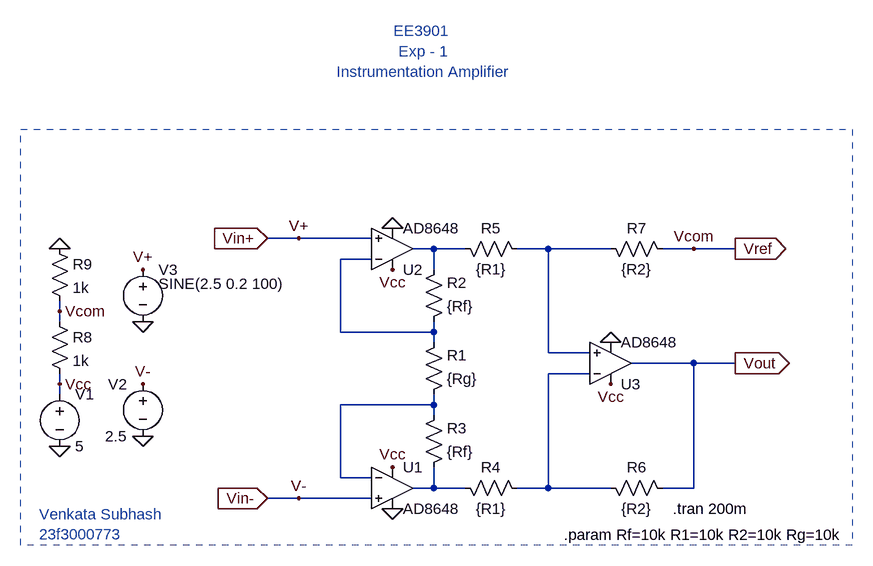
[diagram p0: schematic Exp_1_Instrumentation_amplifier.asc]
Exp_1_Instrumentation_amplifier.asc, the LTspice schematic file:
Version 4
SHEET 1 1060 680
WIRE 160 192 112 192
WIRE 272 192 160 192
WIRE 368 208 336 208
WIRE 416 208 368 208
WIRE 544 208 496 208
WIRE 640 208 544 208
WIRE 768 208 720 208
WIRE 832 208 768 208
WIRE 272 224 224 224
WIRE 368 240 368 208
WIRE -208 304 -208 288
WIRE -208 320 -208 304
WIRE 224 336 224 224
WIRE 368 336 368 320
WIRE 368 336 224 336
WIRE 368 352 368 336
WIRE 544 368 544 208
WIRE 608 368 544 368
WIRE 768 384 672 384
WIRE 832 384 768 384
WIRE 608 400 544 400
WIRE -208 416 -208 400
WIRE -208 432 -208 416
WIRE 368 448 368 432
WIRE 368 448 224 448
WIRE 368 464 368 448
WIRE 224 560 224 448
WIRE 272 560 224 560
WIRE 368 576 368 544
WIRE 368 576 336 576
WIRE 416 576 368 576
WIRE 544 576 544 400
WIRE 544 576 496 576
WIRE 640 576 544 576
WIRE 768 576 768 384
WIRE 768 576 720 576
WIRE 160 592 112 592
WIRE 272 592 160 592
FLAG -208 512 0
FLAG 304 608 0
FLAG 304 176 0
FLAG 640 352 0
FLAG -208 416 Vcc
FLAG 304 544 Vcc
FLAG 304 240 Vcc
FLAG 640 416 Vcc
FLAG 112 592 Vin-
IOPIN 112 592 In
FLAG 112 192 Vin+
IOPIN 112 192 In
FLAG 832 384 Vout
IOPIN 832 384 Out
FLAG 832 208 Vref
IOPIN 832 208 Out
FLAG -208 304 Vcom
FLAG -208 208 0
FLAG -80 320 0
FLAG -80 496 0
FLAG -80 240 V+
FLAG 160 192 V+
FLAG -80 416 V-
FLAG 160 592 V-
FLAG 768 208 Vcom
SYMBOL AD8648 304 272 M180
SYMATTR InstName U2
SYMBOL AD8648 640 448 M180
SYMATTR InstName U3
SYMBOL Voltage -208 416 R0
SYMATTR InstName V1
SYMATTR Value 5
SYMBOL AD8648 304 512 R0
SYMATTR InstName U1
SYMBOL Res 352 448 M180
WINDOW 0 36 76 Left 2
WINDOW 3 36 40 Left 2
SYMATTR InstName R1
SYMATTR Value {Rg}
SYMBOL Res 352 336 M180
WINDOW 0 36 76 Left 2
WINDOW 3 36 40 Left 2
SYMATTR InstName R2
SYMATTR Value {Rf}
SYMBOL Res 352 560 M180
WINDOW 0 36 76 Left 2
WINDOW 3 36 40 Left 2
SYMATTR InstName R3
SYMATTR Value {Rf}
SYMBOL Res 512 592 M270
WINDOW 0 32 56 VTop 2
WINDOW 3 0 56 VBottom 2
SYMATTR InstName R4
SYMATTR Value {R1}
SYMBOL Res 512 224 M270
WINDOW 0 32 56 VTop 2
WINDOW 3 0 56 VBottom 2
SYMATTR InstName R5
SYMATTR Value {R1}
SYMBOL Res 736 592 M270
WINDOW 0 32 56 VTop 2
WINDOW 3 0 56 VBottom 2
SYMATTR InstName R6
SYMATTR Value {R2}
SYMBOL Res 736 224 M270
WINDOW 0 32 56 VTop 2
WINDOW 3 0 56 VBottom 2
SYMATTR InstName R7
SYMATTR Value {R2}
SYMBOL Res -224 304 R0
SYMATTR InstName R8
SYMATTR Value 1k
SYMBOL Res -224 192 R0
SYMATTR InstName R9
SYMATTR Value 1k
SYMBOL Voltage -80 400 M0
SYMATTR InstName V2
SYMATTR Value 2.5
SYMBOL Voltage -80 224 R0
WINDOW 3 24 38 Left 2
SYMATTR Value SINE(2.5 0.2 100)
SYMATTR InstName V3
SYMATTR Value2 AC 0.5
TEXT 568 648 Left 2 !.param Rf=10k R1=10k R2=10k Rg=10k
TEXT 736 608 Left 2 !.tran 200m
TEXT 352 -96 Center 2 ;EE3901 \nExp - 1\nInstrumentation Amplifier
TEXT -240 616 Left 2 ;Venkata Subhash \n23f3000773
RECTANGLE Normal -268 24 1012 664 2

The netlist it stands for:
* Exp_1_Instrumentation_amplifier.asc
XU2 V+ N003 Vcc 0 N001 AD8648  ; pins In+ In- V+ V- OUT
XU3 N002 N004 Vcc 0 Vout AD8648  ; pins In+ In- V+ V- OUT
V1 Vcc 0 5
XU1 V- N005 Vcc 0 N006 AD8648  ; pins In+ In- V+ V- OUT
R1 N005 N003 {Rg}
R2 N003 N001 {Rf}
R3 N006 N005 {Rf}
R4 N004 N006 {R1}
R5 N002 N001 {R1}
R6 Vout N004 {R2}
R7 Vcom N002 {R2}
R8 Vcom Vcc 1k
R9 0 Vcom 1k
V2 V- 0 2.5
V3 V+ 0 SINE(2.5 0.2 100) AC 0.5
.param Rf=10k R1=10k R2=10k Rg=10k
.tran 200m
* EE3901
* Exp - 1
* Instrumentation Amplifier
* Venkata Subhash
* 23f3000773
.lib ADI.lib
.backanno
.end